# EAGLE schematic JCO_High_Level_Hardware_Design (EAGLE 6.4)
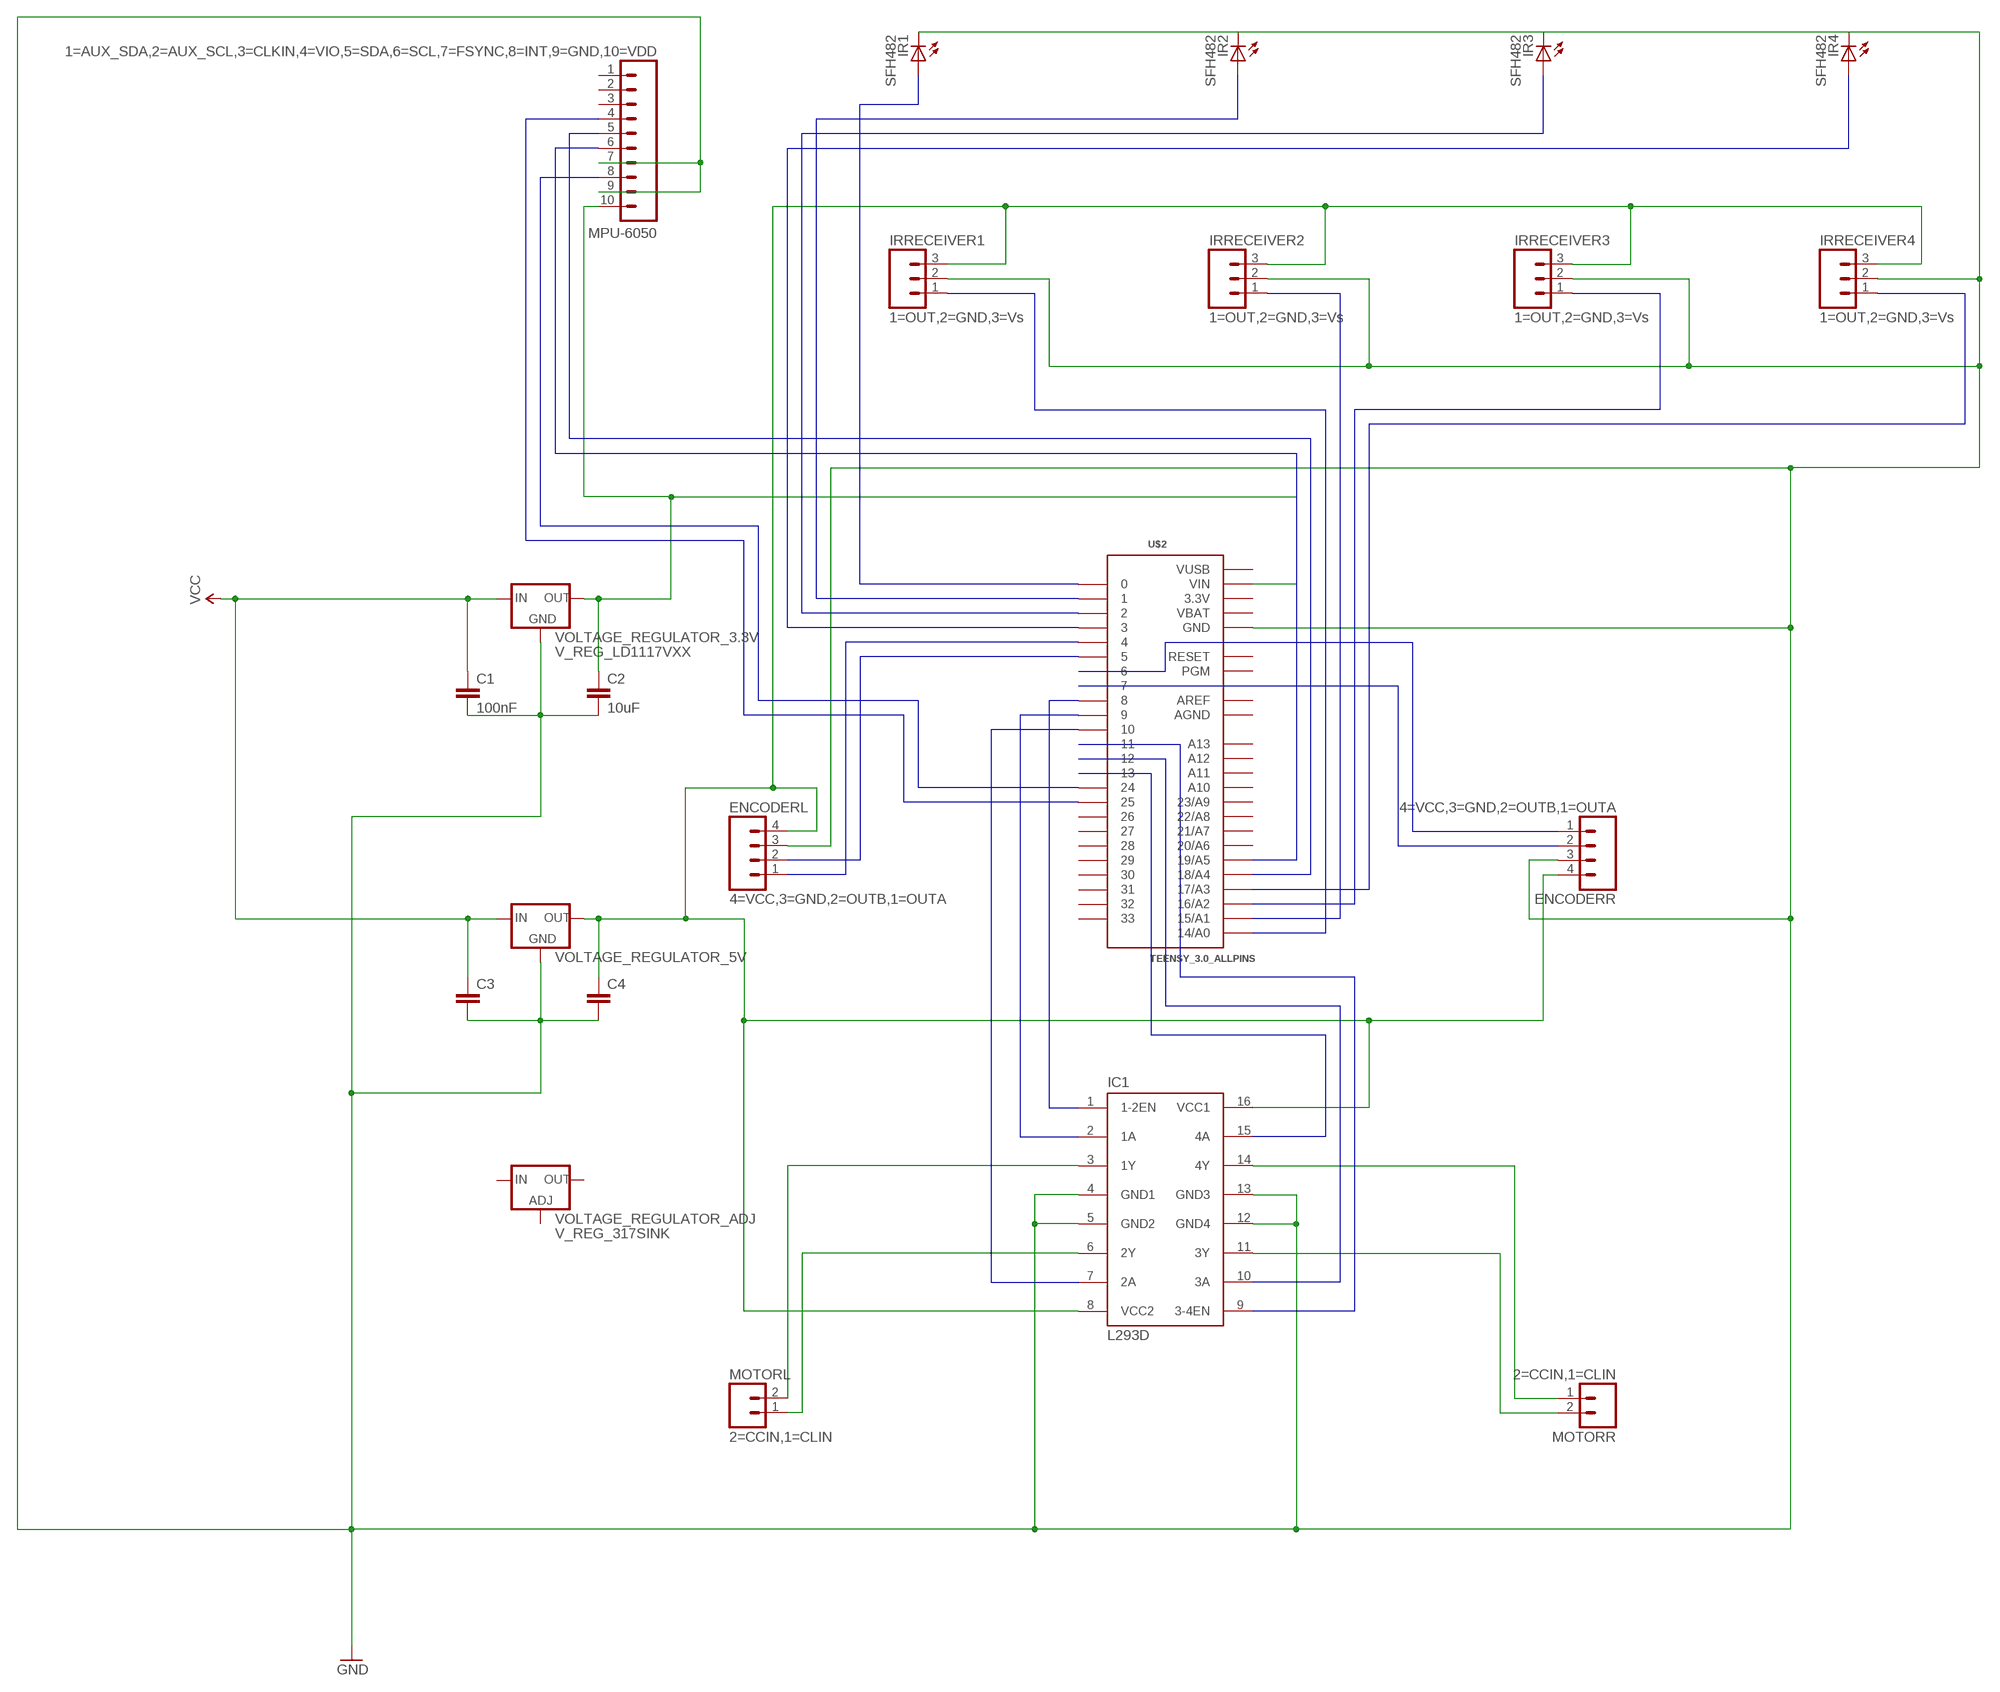
[diagram p0: schematic, sheet 1]

## Parts
C1  100nF  CAP1206  [1206]
C2  10uF  CAP1206  [1206]
C3  CAP1206  [1206]
C4  CAP1206  [1206]
ENCODERL  4=VCC,3=GND,2=OUTB,1=OUTA  M04JST-PTH  [JST-4-PTH]
ENCODERR  4=VCC,3=GND,2=OUTB,1=OUTA  M04JST-PTH  [JST-4-PTH]
IC1  L293D  [DIL16]
IR1  SFH482  [SFH482]
IR2  SFH482  [SFH482]
IR3  SFH482  [SFH482]
IR4  SFH482  [SFH482]
IRRECEIVER1  1=OUT,2=GND,3=Vs  M03  [JST-3-SMD]
IRRECEIVER2  1=OUT,2=GND,3=Vs  M03  [JST-3-SMD]
IRRECEIVER3  1=OUT,2=GND,3=Vs  M03  [JST-3-SMD]
IRRECEIVER4  1=OUT,2=GND,3=Vs  M03  [JST-3-SMD]
MOTORL  2=CCIN,1=CLIN  M02JST-PTH-2  [JST-2-PTH]
MOTORR  2=CCIN,1=CLIN  M02JST-PTH-2  [JST-2-PTH]
MPU-6050  1=AUX_SDA,2=AUX_SCL,3=CLKIN,4=VIO,5=SDA,6=SCL,7=FSYNC,8=INT,9=GND,10=VDD  M10"  [1X10]
U$2  TEENSY_3.0_ALLPINS  [TEENSY_3.0_ALLPINS]
VOLTAGE_REGULATOR_3.3V  V_REG_LD1117VXX  [78XXL]
VOLTAGE_REGULATOR_5V  V_REG_78XXSINK  [TO220-IGO]
VOLTAGE_REGULATOR_ADJ  V_REG_317SINK  [TO220-ADJ]

## Nets
GND: C1.2 C2.2 C3.2 C4.2 ENCODERL.3 ENCODERR.3 IC1.4(GND1) IC1.5(GND2) IC1.12(GND4) IC1.13(GND3) IR1.K(C) IR2.K(C) IR3.K(C) IR4.K(C) IRRECEIVER1.2 IRRECEIVER2.2 IRRECEIVER3.2 IRRECEIVER4.2 MPU-6050.7 MPU-6050.9 U$2.GND U$2.GND1(GND) U$2.GND2(GND) VOLTAGE_REGULATOR_3.3V.IN(GND) VOLTAGE_REGULATOR_5V.GND
N$1: C2.1 MPU-6050.10 U$2.VIN VOLTAGE_REGULATOR_3.3V.GND(OUT)
N$2: IC1.3(1Y) MOTORL.2
N$3: IC1.6(2Y) MOTORL.1
N$4: C4.1 ENCODERL.4 ENCODERR.4 IC1.8(VCC2) IC1.16(VCC1) IRRECEIVER1.3 IRRECEIVER2.3 IRRECEIVER3.3 IRRECEIVER4.3 VOLTAGE_REGULATOR_5V.OUT
N$5: IC1.14(4Y) MOTORR.1
N$6: IC1.11(3Y) MOTORR.2
VCC: C1.1 C3.1 VOLTAGE_REGULATOR_3.3V.OUT(IN) VOLTAGE_REGULATOR_5V.IN
Unconnected: ENCODERL.1 ENCODERL.2 ENCODERR.1 ENCODERR.2 IC1.1(1-2EN) IC1.2(1A) IC1.7(2A) IC1.9(3-4EN) IC1.10(3A) IC1.15(4A) IR1.A IR2.A IR3.A IR4.A IRRECEIVER1.1 IRRECEIVER2.1 IRRECEIVER3.1 IRRECEIVER4.1 MPU-6050.1 MPU-6050.2 MPU-6050.3 MPU-6050.4 MPU-6050.5 MPU-6050.6 MPU-6050.8 U$2.0 U$2.1 U$2.2 U$2.3 U$2.4 U$2.5 U$2.6 U$2.7 U$2.8 U$2.9 U$2.10 U$2.11 U$2.12 U$2.13 U$2.14/A0 U$2.15/A1 U$2.16/A2 U$2.17/A3 U$2.18/A4 U$2.19/A5 U$2.20/A6 U$2.21/A7 U$2.22/A8 U$2.23/A9 U$2.24 U$2.25 U$2.26 U$2.27 U$2.28 U$2.29 U$2.30 U$2.31 U$2.32 U$2.33 U$2.A10 U$2.A11 U$2.A12 U$2.A13 U$2.PGM U$2.RESET VOLTAGE_REGULATOR_ADJ.ADJ VOLTAGE_REGULATOR_ADJ.IN VOLTAGE_REGULATOR_ADJ.OUT

## Buses
B$1
B$2
B$3
B$4
B$7
B$8
B$5
B$6
B$9
B$10
B$11
B$12
B$13
B$14
B$15
B$16
B$17
B$18
B$19
B$20
B$21
B$22

## Power pins joined to a net without a drawn wire
3.3V: U$2.3.3V U$2.3.3V1(3.3V) U$2.3.3V2(3.3V)
AGND: U$2.AGND
AREF: U$2.AREF
VBAT: U$2.VBAT
VUSB: U$2.VUSB

## Library data of the parts
C1-C4 = SparkFun-Capacitors:CAP: Capacitor Standard 0603 ceramic capacitor, and 0.1" leaded capacitor.
ENCODERL ENCODERR = SparkFun-Connectors:M04: Header 4 Standard 4-pin 0.1" header. Use with straight break away headers (SKU : PRT-00116), right angle break away headers (PRT-00553), swiss pins (PRT-00743), machine pins (PRT-00117), and female headers (PRT-00115). Molex polarized connector foot print use with SKU : PRT-08231 with associated crimp pins and housings. 1MM SMD Version SKU: PRT-10208
IC1 = st-microelectronics:L293D: PUSH-PULL 4 CHANNEL DRIVER; MPN: L293D; OC_FARNELL: 9589619; OC_NEWARK: 56P8249
IR1-IR4 = led:SFH482: IR LED infrared emitting diode, Infineon
IRRECEIVER1-IRRECEIVER4 = SparkFun-Connectors:M03: Header 3 Standard 3-pin 0.1" header. Use with straight break away headers (SKU : PRT-00116), right angle break away headers (PRT-00553), swiss pins (PRT-00743), machine pins (PRT-00117), and female headers (PRT-00115). Molex polarized connector foot print use with SKU : PRT-08232 with associated crimp pins and housings.
MOTORL MOTORR = SparkFun-Connectors:M02: Header 2 Standard 2-pin 0.1" header. Use with straight break away headers (SKU : PRT-00116), right angle break away headers (PRT-00553), swiss pins (PRT-00743), machine pins (PRT-00117), and female headers (PRT-00115). Molex polarized connector foot print use with SKU : PRT-08233 with associated crimp pins and housings.
MPU-6050 = SparkFun-Connectors:M10: Header 10 Standard 10-pin 0.1" header. Use with straight break away headers (SKU : PRT-00116), right angle break away headers (PRT-00553), swiss pins (PRT-00743), machine pins (PRT-00117), and female headers (PRT-00115).
U$2 = Teensy3.0:TEENSY_3.0_ALLPINS: Teensy 3.0 with all pin holes and optional SMD-mount unshrouded header on bottom of Teensy 3.0. For more basic versions, see 'Basic', '+4' and 'AllAnalogPins'. Requires the installation of a un-shrouded SMD header on the underside of the Teensy 3.0
VOLTAGE_REGULATOR_3.3V = SparkFun-PowerIC:V_REG_LD1117VXX: LD1117VXX voltage regulator. We carry the 3.3V version (COM-00526) in TO-220 package.
VOLTAGE_REGULATOR_5V = SparkFun-PowerIC:V_REG_78XX: Voltage Regulator Standard 7805 5V regulator. IGO (Input Ground Output). Spark Fun Electronics SKU : COM-00107
VOLTAGE_REGULATOR_ADJ = SparkFun-PowerIC:V_REG_317: Voltage Regulator Standard LM317 adjustable voltage regulator. AOI (Adjust Output Input). Google 'LM317 Calculator' for easy to use app to get the two resistor values needed. 240/720 for 5V output. 240/390 for 3.3V output. Spark Fun Electronics SKU : COM-00527